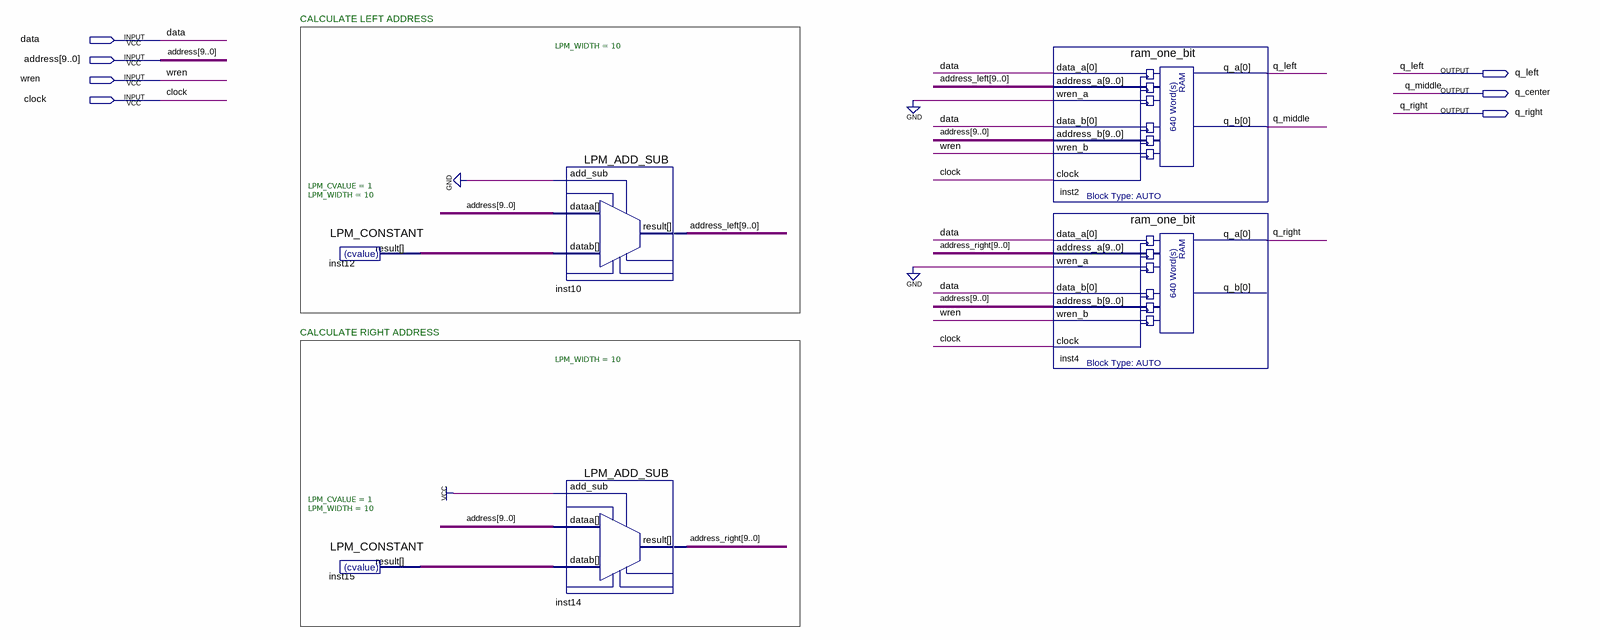
[diagram p0: schematic sheet]
// Quartus schematic parallel_ram_one_bit.bdf as structural Verilog: 6 symbols, 7 pins
module parallel_ram_one_bit (
  input  data,
  input  [9:0] address,
  input  wren,
  input  clock,
  output q_left,
  output q_center,
  output q_right
);

  wire [9:0] address_left, address_right, inst12_result, inst15_result;

  LPM_CONSTANT #(.LPM_CVALUE(1), .LPM_WIDTH(10)) inst12 (.result(inst12_result));
  LPM_CONSTANT #(.LPM_CVALUE(1), .LPM_WIDTH(10)) inst15 (.result(inst15_result));
  LPM_ADD_SUB #(.LPM_WIDTH(10)) inst10 (.datab(inst12_result), .add_sub(1'b0), .dataa(address), .result(address_left));
  LPM_ADD_SUB #(.LPM_WIDTH(10)) inst14 (.datab(inst15_result), .add_sub(1'b1), .dataa(address), .result(address_right));
  ram_one_bit inst2 (
    .data_a(data), .address_a(address_left), .wren_a(1'b0), .data_b(data), .address_b(address),
    .wren_b(wren), .clock(clock), .q_a(q_left), .q_b(q_center));
  ram_one_bit inst4 (
    .data_a(data), .address_a(address_right), .wren_a(1'b0), .data_b(data), .address_b(address),
    .wren_b(wren), .clock(clock), .q_a(q_right));  // open: q_b

  // Other names for the same wires on the sheet: q_middle = q_center

  // Notes on the sheet:
  //   CALCULATE LEFT ADDRESS
  //   CALCULATE RIGHT ADDRESS
endmodule
